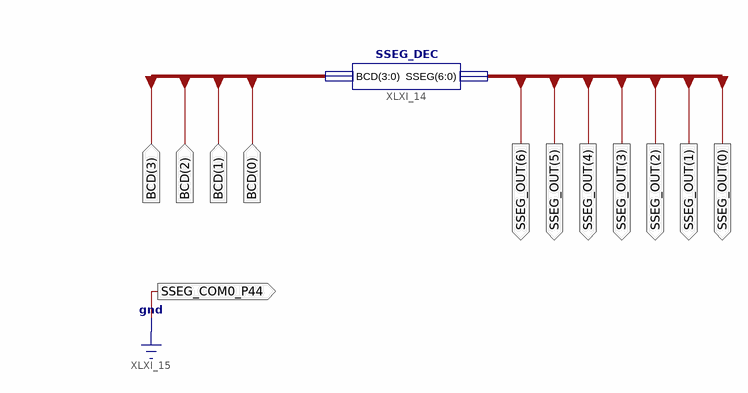
[diagram p0: schematic sheet 1]
// Xilinx ISE schematic main.sch (spartan6) as structural Verilog: 1 symbols, 12 ports
module main (
  input  [3:0] BCD,
  output [6:0] SSEG_OUT,
  output SSEG_COM0_P44
);

  SSEG_DEC XLXI_14 (.BCD(BCD), .SSEG(SSEG_OUT));

  assign SSEG_COM0_P44 = 1'b0;
endmodule
